# Altium schematic sheet DM1097_Power_Supply.SchDoc: =project_title (part 1 of 3)
size Tabloid; PageSetup: Record=PageOptions|CenterHorizontal=True|CenterVertical=True|PrintScale=0.73|XCorrection=1.00|YCorrection=1.00|PrintKind=0|BorderSize=5000000|LeftOffset=0|BottomOffset=0|Orientation=2|PaperLength=1000|PaperWidth=1000|Scale=100|PaperSource=7|PrintQuality=-4|MediaType=1|DitherType=10|PaperKind=A4|PrintScaleMode=1; CompanyName: Luxonis Holding; Organization: Luxonis Holding; Address1: 1925 Harmony Park Drive; Address2: Westminster, CO; Address3: 80234; Address4: United States; SheetNumber: 7; SheetTotal: 17
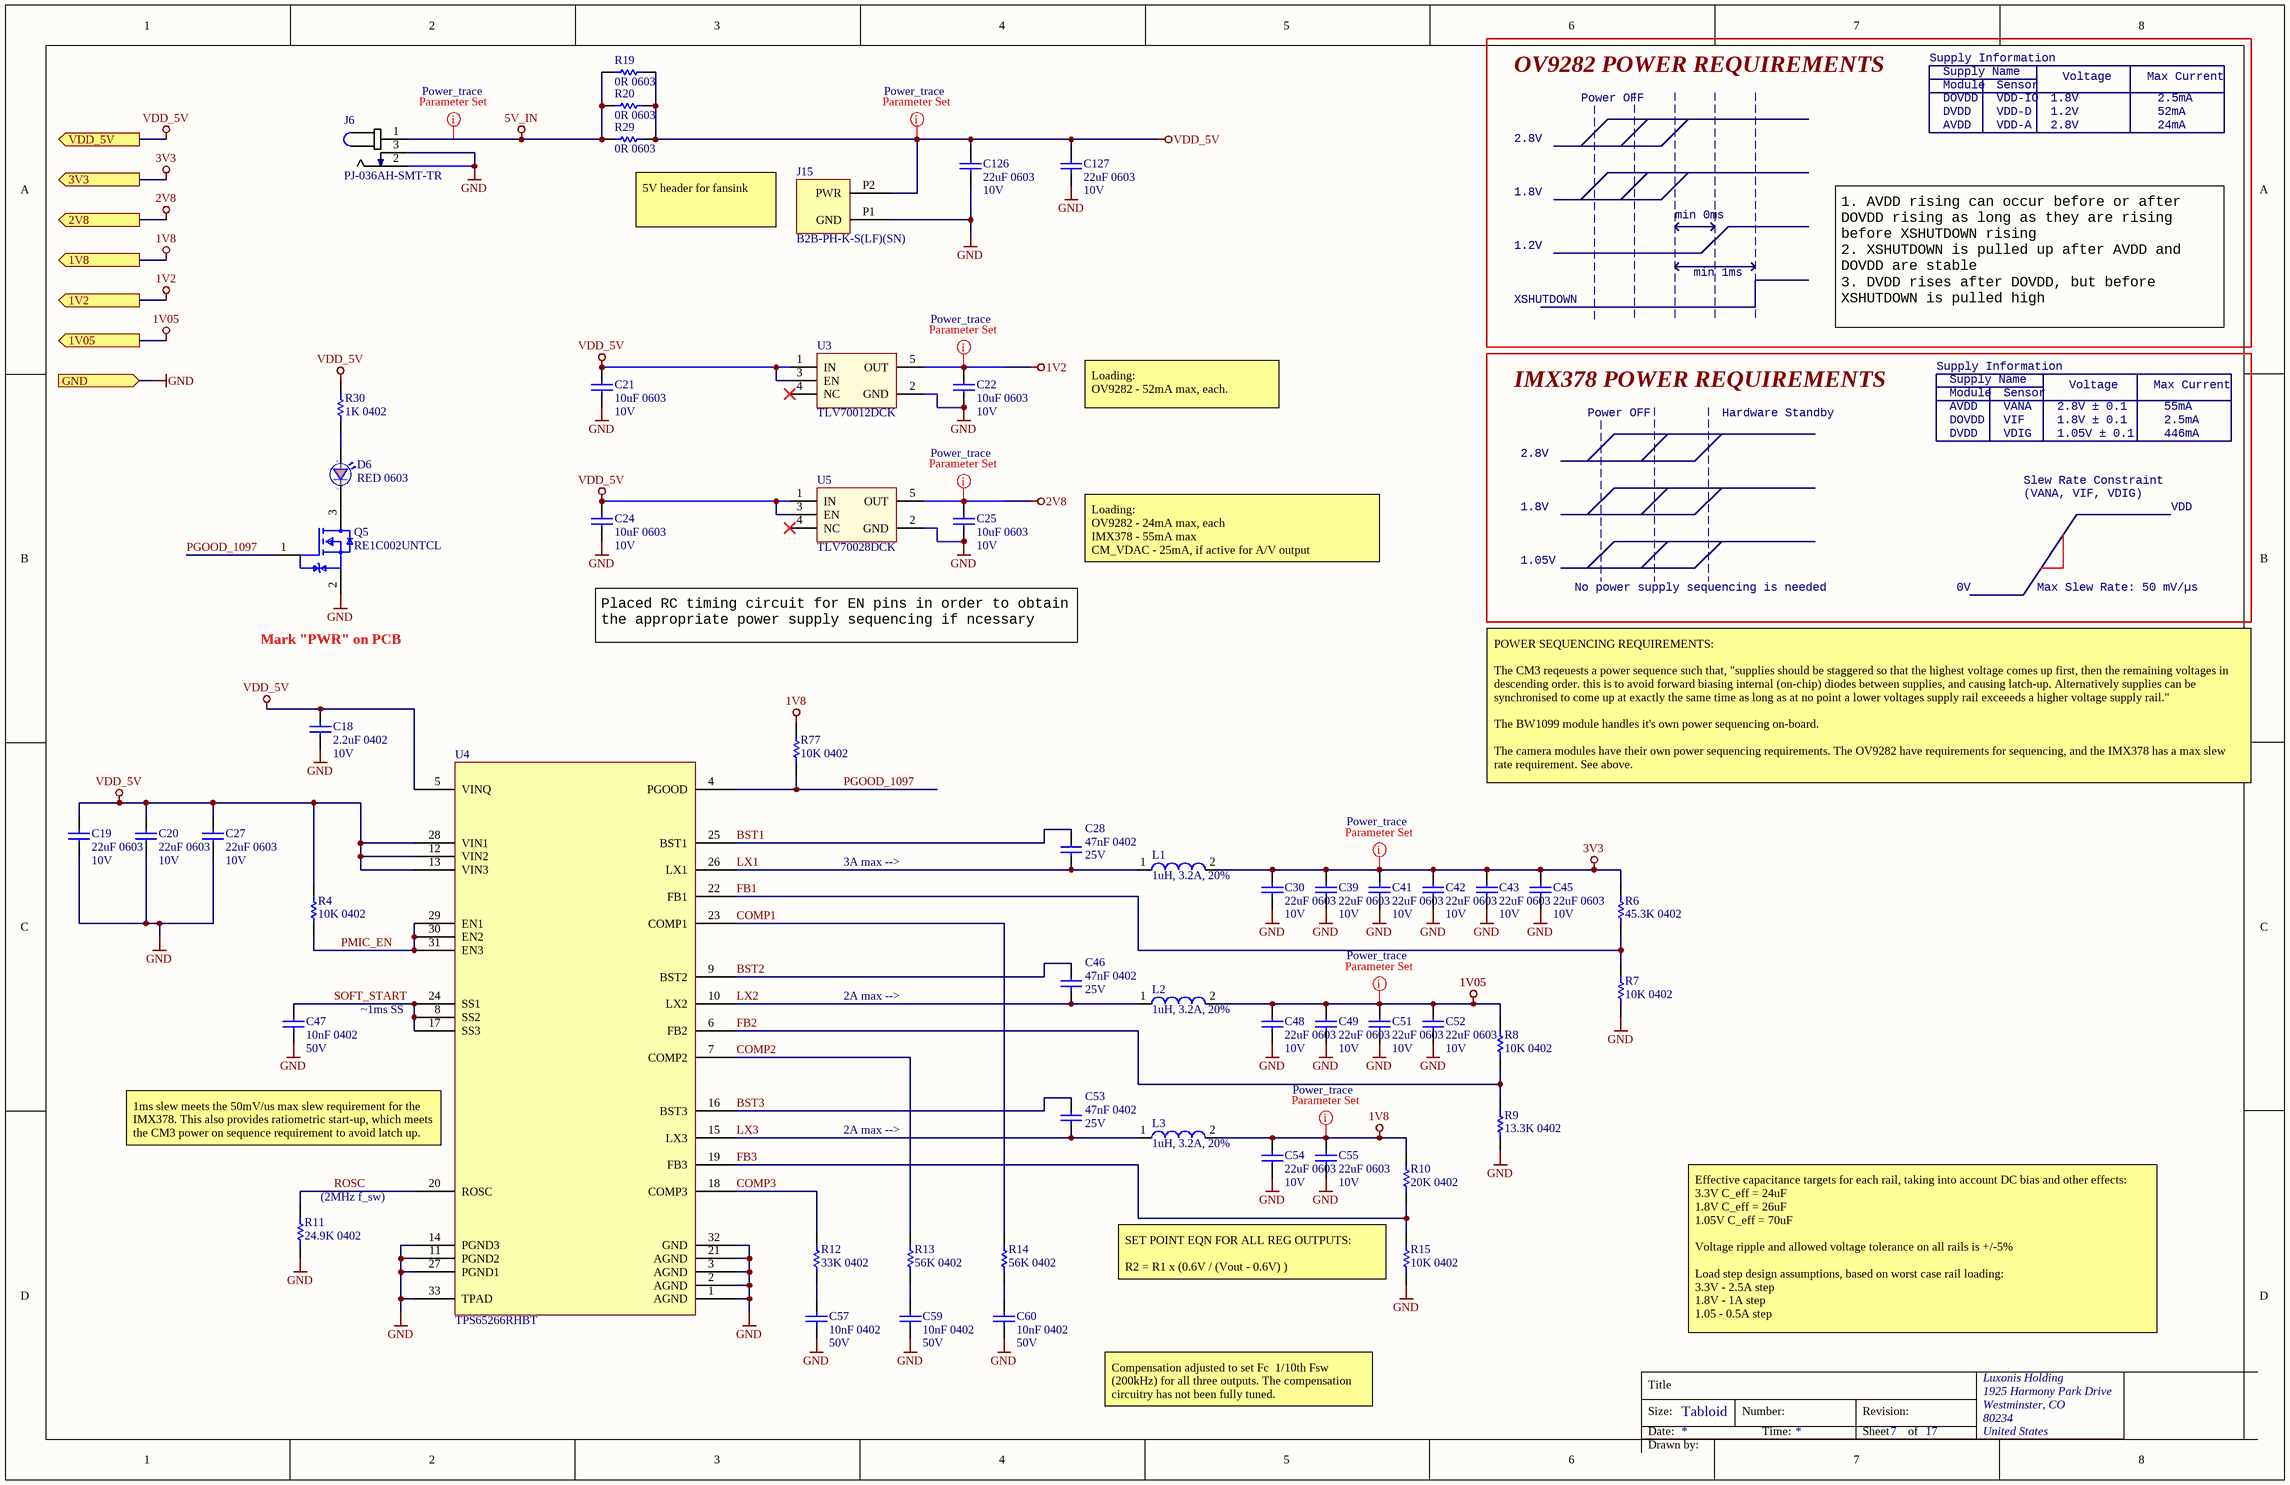
[diagram p0: DM1097_Power_Supply.SchDoc]

## Parts
C18  2.2uF 0402  Voltage Rating: 10V  [CAPC0402(1005)70_N]
C19  22uF 0603  Voltage Rating: 10V  [CAPC0603(1608)100_N]
C20  22uF 0603  Voltage Rating: 10V  [CAPC0603(1608)100_N]
C21  10uF 0603  Voltage Rating: 10V  [CAPC0603(1608)100_N]
C22  10uF 0603  Voltage Rating: 10V  [CAPC0603(1608)100_N]
C24  10uF 0603  Voltage Rating: 10V  [CAPC0603(1608)100_N]
C25  10uF 0603  Voltage Rating: 10V  [CAPC0603(1608)100_N]
C27  22uF 0603  Voltage Rating: 10V  [CAPC0603(1608)100_N]
C28  47nF 0402  Voltage: 25V  [CAPC0402(1005)70_N]
C30  22uF 0603  Voltage Rating: 10V  [CAPC0603(1608)100_N]
C39  22uF 0603  Voltage Rating: 10V  [CAPC0603(1608)100_N]
C41  22uF 0603  Voltage Rating: 10V  [CAPC0603(1608)100_N]
C42  22uF 0603  Voltage Rating: 10V  [CAPC0603(1608)100_N]
C43  22uF 0603  Voltage Rating: 10V  [CAPC0603(1608)100_N]
C45  22uF 0603  Voltage Rating: 10V  [CAPC0603(1608)100_N]
C46  47nF 0402  Voltage: 25V  [CAPC0402(1005)70_N]
C47  10nF 0402  Voltage Rating: 50V  [CAPC0402(1005)60_N]
C48  22uF 0603  Voltage Rating: 10V  [CAPC0603(1608)100_N]
C49  22uF 0603  Voltage Rating: 10V  [CAPC0603(1608)100_N]
C51  22uF 0603  Voltage Rating: 10V  [CAPC0603(1608)100_N]
C52  22uF 0603  Voltage Rating: 10V  [CAPC0603(1608)100_N]
C53  47nF 0402  Voltage: 25V  [CAPC0402(1005)70_N]
C54  22uF 0603  Voltage Rating: 10V  [CAPC0603(1608)100_N]
C55  22uF 0603  Voltage Rating: 10V  [CAPC0603(1608)100_N]
C57  10nF 0402  Voltage Rating: 50V  [CAPC0402(1005)60_N]
C59  10nF 0402  Voltage Rating: 50V  [CAPC0402(1005)60_N]
C60  10nF 0402  Voltage Rating: 50V  [CAPC0402(1005)60_N]
C126  22uF 0603  Voltage Rating: 10V  [CAPC0603(1608)100_N]
C127  22uF 0603  Voltage Rating: 10V  [CAPC0603(1608)100_N]
D6  RED 0603  [SML_D1xx8W]
J6  PJ-036AH-SMT-TR  [PJ-036AH-SMT]
J15  B2B-PH-K-S(LF)(SN)  [B2B-PH-K-S(LF)(SN)]
L1  1uH, 3.2A, 20%  [DFE252012P-1R0M=P2]
L2  1uH, 3.2A, 20%  [DFE252012P-1R0M=P2]
L3  1uH, 3.2A, 20%  [DFE252012P-1R0M=P2]
Q5  RE1C002UNTCL  [RE1C002UNTCL]
R4  10K 0402  [RESC0402(1005)_N]
R6  45.3K 0402  [RESC0402(1005)_N]
R7  10K 0402  [RESC0402(1005)_N]
R8  10K 0402  [RESC0402(1005)_N]
R9  13.3K 0402  [RESC0402(1005)_N]
R10  20K 0402  [RESC0402(1005)_N]
R11  24.9K 0402  [RESC0402(1005)_N]
R12  33K 0402  [RESC0402(1005)_N]
R13  56K 0402  [RESC0402(1005)_N]
R14  56K 0402  [RESC0402(1005)_N]
R15  10K 0402  [RESC0402(1005)_N]
R19  0R 0603  [RESC0603(1608)_N]
R20  0R 0603  [RESC0603(1608)_N]
R29  0R 0603  [RESC0603(1608)_N]
R30  1K 0402  [RESC0402(1005)_N]
R77  10K 0402  [RESC0402(1005)_N]
U3  TLV70012DCK  [TLV70012DCK]
U4  TPS65266RHBT  [TPS65266RHBT]
U5  TLV70028DCK  [TLV70028DCK]

## Ports
1V2 (out), 1V05 (out), 1V8 (out), 2V8 (out), 3V3 (out), GND (in), VDD_5V (out)

## Nets
1V2: C22.2 U3.5(OUT) ; port 1V2
1V05: C48.1 C49.1 C51.1 C52.1 L2.2 R8.2 ; port 1V05
1V8: C54.1 C55.1 L3.2 R10.2 R77.2 ; port 1V8
2V8: C25.2 U5.5(OUT) ; port 2V8
3V3: C30.1 C39.1 C41.1 C42.1 C43.1 C45.1 L1.2 R6.2 ; port 3V3
5V_IN: J6.1 R19.2 R20.2 R29.2
GND: C18.2 C19.2 C20.2 C21.1 C22.1 C24.1 C25.1 C27.2 C30.2 C39.2 C41.2 C42.2 C43.2 C45.2 C47.2 C48.2 C49.2 C51.2 C52.2 C54.2 C55.2 C57.2 C59.2 C60.2 C126.2 C127.2 J6.2 J6.3 J15.P1(GND) Q5.2(Source) R7.1 R9.1 R11.1 R15.1 U3.2(GND) U4.1(AGND) U4.2(AGND) U4.3(AGND) U4.11(PGND2) U4.14(PGND3) U4.21(AGND) U4.27(PGND1) U4.32(GND) U4.33(TPAD) U5.2(GND) ; port GND
VDD_5V: C18.1 C19.1 C20.1 C21.2 C24.2 C27.1 C126.1 C127.1 J15.P2(PWR) R4.2 R19.1 R20.1 R29.1 R30.2 U3.1(IN) U3.3(EN) U4.5(VINQ) U4.12(VIN2) U4.13(VIN3) U4.28(VIN1) U5.1(IN) U5.3(EN) ; port VDD_5V
BST1: C28.1 U4.25(BST1)
BST2: C46.1 U4.9(BST2)
BST3: C53.1 U4.16(BST3)
COMP1: R14.2 U4.23(COMP1)
COMP2: R13.2 U4.7(COMP2)
COMP3: R12.2 U4.18(COMP3)
FB1: R6.1 R7.2 U4.22(FB1)
FB2: R8.1 R9.2 U4.6(FB2)
FB3: R10.1 R15.2 U4.19(FB3)
LX1: C28.2 L1.1 U4.26(LX1)
LX2: C46.2 L2.1 U4.10(LX2)
LX3: C53.2 L3.1 U4.15(LX3)
PGOOD_1097: Q5.1(Gate) R77.1 U4.4(PGOOD)
PMIC_EN: R4.1 U4.29(EN1) U4.30(EN2) U4.31(EN3)
ROSC: R11.2 U4.20(ROSC)
SOFT_START: C47.1 U4.8(SS2) U4.17(SS3) U4.24(SS1)
NetC57_1: C57.1 R12.1
NetC59_1: C59.1 R13.1
NetC60_1: C60.1 R14.1
NetD6_1: D6.1(C) Q5.3(Drain)
NetD6_2: D6.2(A) R30.1

Not connected (* = marked no-connect by the designer): U3 4(NC)*; U5 4(NC)*

## Layout directives
net class Power_trace: 1V2, 1V05, 1V8, 2V8, 3V3, 5V_IN, VDD_5V

## Notes on the sheet
- OV9282 POWER REQUIREMENTS
- Supply Information
- Supply Name
- Module
- Sensor
- Voltage
- Max Current
- 2.8V
- Power OFF
- AVDD
- DOVDD
- DVDD
- VDD-A
- VDD-IO
- VDD-D
- 1.8V
- 1.2V
- 24mA
- 2.5mA
- 52mA
- (near R29) 5V header for fansink
- min 0ms
- XSHUTDOWN
- min 1ms
- 1. AVDD rising can occur before or after DOVDD rising as long as they are rising before XSHUTDOWN rising
  2. XSHUTDOWN is pulled up after AVDD and DOVDD are stable
  3. DVDD rises after DOVDD, but before XSHUTDOWN is pulled high
- Loading:
  OV9282 - 52mA max, each.
- IMX378 POWER REQUIREMENTS
- Hardware Standby
- VANA
- VIF
- VDIG
- 2.8V ± 0.1
- 1.8V ± 0.1
- 1.05V ± 0.1
- 55mA
- 446mA
- Slew Rate Constraint
- (VANA, VIF, VDIG)
- Loading:
  OV9282 - 24mA max, each
  IMX378 - 55mA max
  CM_VDAC - 25mA, if active for A/V output
- 1.05V
- VDD
- No power supply sequencing is needed
- 0V
- Max Slew Rate: 50 mV/µs
- Mark "PWR" on PCB
- Placed RC timing circuit for EN pins in order to obtain the appropriate power supply sequencing if ncessary
- POWER SEQUENCING REQUIREMENTS:
  The CM3 reqeuests a power sequence such that, "supplies should be staggered so that the highest voltage comes up first, then the remaining voltages in descending order. this is to avoid forward biasing internal (on-chip) diodes between supplies, and causing latch-up. Alternatively supplies can be synchronised to come up at exactly the same time as long as at no point a lower voltages supply rail exceeeds a higher voltage supply rail."
  The BW1099 module handles it's own power sequencing on-board.
  The camera modules have their own power sequencing requirements. The OV9282 have requirements for sequencing, and the IMX378 has a max slew rate requirement. See above.
- 3A max -->
- ~1ms SS
- 2A max -->
- (near U4) 1ms slew meets the 50mV/us max slew requirement for the IMX378. This also provides ratiometric start-up, which meets the CM3 power on sequence requirement to avoid latch up.
- (near R11) (2MHz f_sw)
- (near R15) SET POINT EQN FOR ALL REG OUTPUTS:
  R2 = R1 x (0.6V / (Vout - 0.6V) )
- Effective capacitance targets for each rail, taking into account DC bias and other effects:
  3.3V C_eff = 24uF
  1.8V C_eff = 26uF
  1.05V C_eff = 70uF
  Voltage ripple and allowed voltage tolerance on all rails is +/-5%
  Load step design assumptions, based on worst case rail loading:
  3.3V - 2.5A step
  1.8V - 1A step
  1.05 - 0.5A step
- Compensation adjusted to set Fc  1/10th Fsw  (200kHz) for all three outputs. The compensation circuitry has not been fully tuned.
- Title
- Size:
- Date:
- Tabloid
- Number:
- Time:
- Revision:
- Sheet
- of
- Drawn by: